# EasyEDA Pro project Sprig-C3 V1.0.1.epro, board PCB6
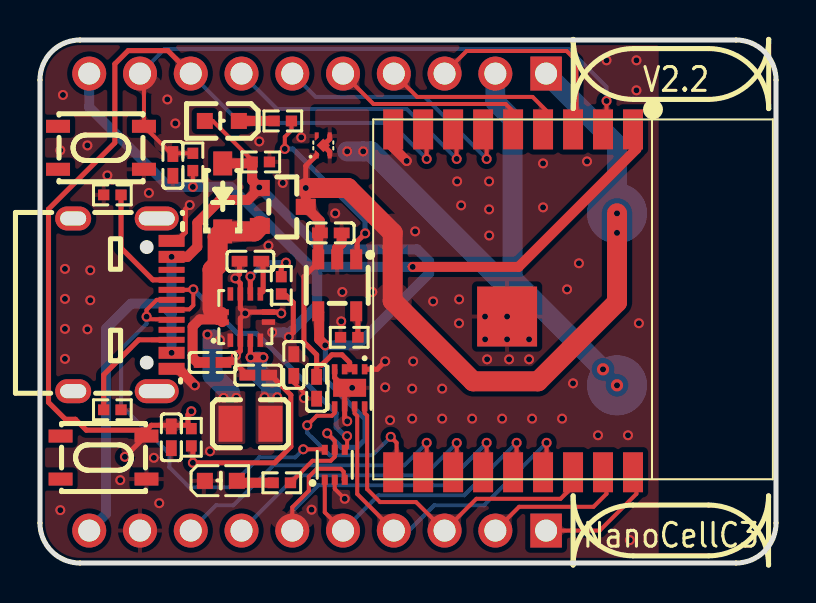
[diagram p8: board, top side]
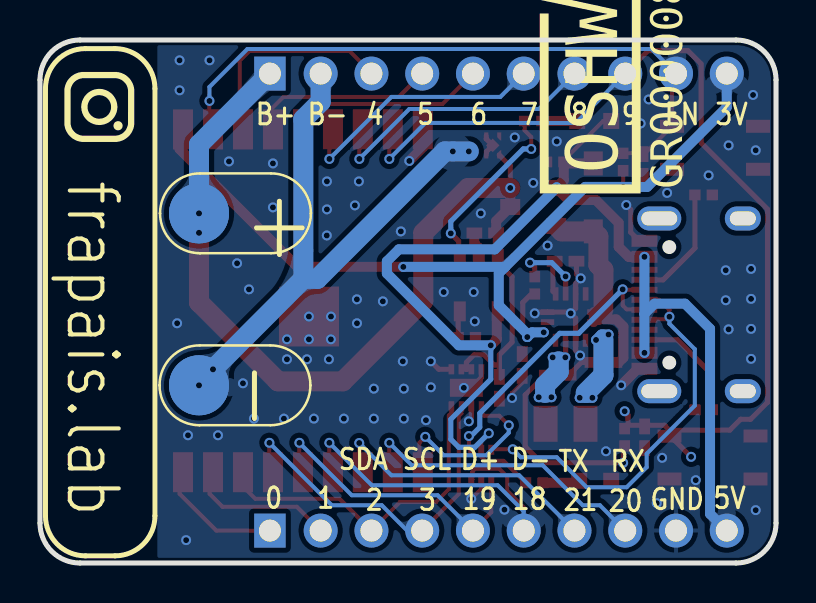
[diagram p9: board, bottom side, seen from below]

Outline 36.83 x 26.16 mm; copper layers: Top Layer, Bottom Layer. Coordinates in mm from the lower left corner of the outline.
Outline path: 0,24.16 0,2 arc(0.59,0.59) 2,0 34.83,0 arc(36.24,0.59) 36.83,2 36.83,24.16 arc(36.24,25.58) 34.83,26.16 2,26.16 arc(0.59,25.58) 0,24.16
Stack: Top Layer 0.035mm / Dielectric1 1.51mm FR4 er 4.5 / Bottom Layer 0.035mm

## Design rules (mm)
template: Custom Config
spacing copperThickness1oz (default): track to track 0.102, other pairs 0.152 to 0.3
spacing copperThickness2oz: track to track 0.203, other pairs 0.152 to 0.3
track width copperThickness1oz (default): min 0.127, default 0.254, max 2.54
track width copperThickness2oz: min 0.203, default 0.254, max 2.54
differential pair differentialPair (default): width min 0.127, default 0.254, max 2.54; gap min 0.152, default 0.152
via viaSize (default): diameter min 0.5, default 0.61, max 10; hole min 0.3, default 0.305, max 6.3
net $2N2104 uses copperRegion1
net $2N2094 uses copperRegion1
net 3.3V uses copperRegion1

## Placement (name value [footprint] x y rotation side)
BOOT  TSA016A2518C  [SW-SMD_4P-L4.2-W3.3-P2.15-LS4.6]  3.18 5.28 0 top
C1  100nF  [C0402]  6.65 19.91 90 top
C2  100nF  [C0402]  6.57 6.29 90 top
C8  100nF  [C0402]  13.84 8.76 90 top
C21  10uF  [C0402]  14.55 16.51 180 top
C22  10uF  [C0402]  10.92 9.4 0 top
C23  10uF  [C0402]  12.7 9.91 90 top
C24  10uF  [C0402]  8.64 10.03 180 top
C25  1nF  [C0402]  10.53 15.09 0 top
CHG1  MHT192CSCT  [LED0603-R-RD_ORANGE]  9.1 22.11 180 top
D1  B5819W SL  [SOD-123_L2.7-W1.6-LS3.7-RD-1]  9.14 18.29 90 top
D2  USBLC6-2P6  [SOT-666-6_L1.6-W1.2-P0.50-LS1.6-BL]  14.75 4.91 0 top
H1  DZ254R-11-10-63  [HDR-TH_10P-P2.54-V-M]  13.89 24.48 180 top
H2  DZ254R-11-10-63  [HDR-TH_10P-P2.54-V-M]  13.89 1.62 180 top
L1  1.5uH  [L0806]  10.53 6.97 180 top
NOREF  -  [Pad_e619]  28.87 8.89 0 top
NOREF#2  -  [Pad_e125]  28.87 8.89 0 top
NOREF#3  -  [Pad_e124]  28.87 17.49 0 top
NOREF#4  -  [Pad_e620]  28.87 17.49 0 top
PWR1  E6C0603CWAY1UDA  [LED0603-R-RD_WHITE]  9.05 4.11 0 top
Q2  AO3401A  [SOT-23_L2.9-W1.3-P1.90-LS2.4-BR]  12.15 17.81 180 top
R1  10kΩ  [R0402]  7.65 20.06 270 top
R2  10kΩ  [R0402]  7.57 6.29 270 top
R3  5.1kΩ  [R0402]  3.62 18.41 180 top
R4  5.1kΩ  [R0402]  3.62 7.66 180 top
R5  510Ω  [R0402]  12.1 4.01 180 top
R6  10kΩ  [R0402]  11.05 20.06 180 top
R7  330Ω  [R0402]  12.15 22.11 0 top
R8  2.32kΩ  [R0402]  15.47 11.29 0 top
R12  1MΩ  [R0402]  12.07 13.89 270 top
RST  TSA016A2518C  [SW-SMD_4P-L4.2-W3.3-P2.15-LS4.6]  3.05 20.77 0 top
U1  2.4GHz  [FOOTPRINT-ESP32-C3-WROOM-02]  29.67 21.69 270 top
U3  MAX17048G+T10  [DFN-8_L2.0-W2.0-P0.50-BL-EP]  15.49 8.76 180 top
U4  TP4065-4.2V-SOT25-R  [SOT-23-5_L3.0-W1.7-P0.95-LS2.8-BR]  14.87 13.89 90 top
U7  TPS63051RMWR  [QFN-12_L2.5-W2.5-P0.50-TL]  10.28 12.3 90 top
U8  AP6683  [DFN-4_L1.0-W1.0-P0.65-BL-EP]  14.17 20.89 0 top
USB1  U262-161N-4BVC11  [USB-3.1-SMD_U262-161N-4BVC11]  4.12 12.91 270 top

## Footprints (pads in the part's own frame, mm; a bottom-side part is the same pattern mirrored in y, then rotated)
C0402
  rect 0.79x0.54 smd: 1(-0.545,0) 2(0.545,0)
DFN-4_L1.0-W1.0-P0.65-BL-EP
  custom 0.2x0.4 smd: 1(-0.325,-0.475) 2(0.325,-0.474) 3(0.325,0.475) 4(-0.325,0.475)
  rect 0.48x0.48 smd rot 45: 5(0.004,0.001)
DFN-8_L2.0-W2.0-P0.50-BL-EP
  rect 0.28x0.505 smd: 1(-0.75,-0.927) 2(-0.25,-0.927) 3(0.25,-0.927) 4(0.75,-0.927) 5(0.75,0.927) 6(0.25,0.927) 7(-0.25,0.927) 8(-0.75,0.927)
  rect 1.65x0.9 smd: 9(0,0)
FOOTPRINT-ESP32-C3-WROOM-02
  rect 2x1 smd: 1(0,0) 2(0,-1.5) 3(0,-3) 4(0,-4.5) 5(0,-6) 6(0,-7.5) 7(0,-9) 8(0,-10.5) 9(0,-12) 10(17.15,-12) 11(17.15,-10.5) 12(17.15,-9) 13(17.15,-7.5) 14(17.15,-6) 15(17.15,-4.5) 16(17.15,-3) 17(17.15,-1.5) 18(17.15,0)
  rect 3x3 smd: 19(9.36,-6.3)
HDR-TH_10P-P2.54-V-M
  rect 1.575x1.7 hole 1.1: 1(-11.43,0)
  round 1.7 hole 1.1: 2(-8.89,0) 3(-6.35,0) 4(-3.81,0) 5(-1.27,0) 6(1.27,0) 7(3.81,0) 8(6.35,0) 9(8.89,0) 10(11.43,0)
L0806
  rect 1.2x1.8 smd: 1(-1,0) 2(1,0)
LED0603-R-RD_ORANGE
  rect 0.8x0.8 smd: 1(0.851,0) 2(-0.851,0)
LED0603-R-RD_WHITE
  rect 0.8x0.8 smd: 1(0.8,0) 2(-0.8,0)
Pad_e124
  round 3 smd far side: 1(0,0)
Pad_e125
  round 3 smd far side: 2(0,0)
Pad_e619
  round 3 smd far side: 2(0,0)
Pad_e620
  round 3 smd far side: 1(0,0)
QFN-12_L2.5-W2.5-P0.50-TL
  rect 0.665x0.28 smd: 1(-1.157,0.75) 2(-1.157,0.25) 3(-1.157,-0.25) 4(-1.157,-0.75) 7(1.157,-0.75) 8(1.157,-0.25) 9(1.157,0.25) 10(1.157,0.75)
  rect 0.28x0.665 smd: 5(-0.25,-1.157) 6(0.25,-1.157) 11(0.25,1.157) 12(-0.25,1.157)
R0402
  rect 0.566x0.54 smd: 1(-0.433,0) 2(0.433,0)
SOD-123_L2.7-W1.6-LS3.7-RD-1
  rect 1.2x0.95 smd: 1(-1.7,0) 2(1.7,0)
SOT-23-5_L3.0-W1.7-P0.95-LS2.8-BR
  rect 1x0.6 smd: 1(1.3,-0.95) 2(1.3,0) 3(1.3,0.95) 4(-1.3,0.95) 5(-1.3,-0.95)
SOT-23_L2.9-W1.3-P1.90-LS2.4-BR
  rect 1x0.8 smd: 1(1.15,-0.95) 2(1.15,0.95) 3(-1.15,0)
SOT-666-6_L1.6-W1.2-P0.50-LS1.6-BL
  rect 0.3x0.5 smd: 1(-0.5,-0.75) 2(0,-0.75) 3(0.5,-0.75) 4(0.5,0.75) 5(0,0.75) 6(-0.5,0.75)
SW-SMD_4P-L4.2-W3.3-P2.15-LS4.6
  rect 1.2x0.65 smd: 1(-2.15,1.075) 2(2.15,1.075) 3(-2.15,-1.075) 4(2.15,-1.075)
USB-3.1-SMD_U262-161N-4BVC11
  rect 0.6x1.3 smd: A1B12(-3.2,2.462) A4B9(-2.4,2.462) B1A12(3.2,2.462) B4A9(2.4,2.462)
  rect 0.3x1.3 smd: A5(-1.25,2.462) A6(-0.25,2.462) A7(0.25,2.462) A8(1.25,2.462) B5(1.75,2.462) B6(0.75,2.462) B7(-0.75,2.462) B8(-1.75,2.462)
  oval 1.2x2.2 hole 0.7x1.8: SHELL(-4.32,1.719) SHELL(4.32,1.719)
  oval 1.2x1.8 hole 0.7x1.3: SHELL(-4.32,-2.462) SHELL(4.32,-2.462)

## Nets
As in the schematic, except:
VBAT: C8.2 C21.2 H1.1 NOREF#3.1 NOREF#4.1 Q2.3 U3.2 U3.3 U4.3 U8.1
B-: H1.2 NOREF.2 NOREF#2.2 U8.2 U8.3 U8.5

Pads without a net: BOOT 1 3; RST 1 3; U7 10; USB1 A8 B8 SHELL

## Via types
v1: diameter 0.5, hole 0.3, Top Layer to Bottom Layer, 123 vias
v2: diameter 0.61, hole 0.305, Top Layer to Bottom Layer, 4 vias

## Routing (per net, layer and track width the routed paths; a pad name or vN(x,y) marks a point on that pad's centre or on a via; arc(x,y) is an arc through that point)
3.3V: length 54.3
  Top Layer w0.2: R1.2 v1(7.65,18.81)
  Top Layer w0.254: C22.2 11.56,9.4 12.55,8.4 12.55,5.82 11.74,5.01 v1(7.65,5.01) 7.65,5.78 R2.2 ; 12.31,13.39 12.67,13.03 12.67,11.53 v1(12.45,11.3)
  Top Layer w0.5: v1(18.65,14.81) 23.95,14.81 29.84,20.71 29.84,21.67
  Bottom Layer w0.5: 13.55,14.81 9.55,18.81 v1(7.65,18.81) 6.45,18.81 2.47,22.8 H1.10 ; 13.55,14.81 13.87,14.49 13.87,12.89 12.45,11.46 v1(12.45,11.3) 12.21,11.54 v1(11.62,11.54) ; 13.55,14.81 v1(18.65,14.81)
GND: length 22.6
  Top Layer w0.2: v1(15.25,3.21) 14.75,3.71 D2.2 ; v1(13.21,8.25) 13.21,8.51 12.7,9.02 C23.1
  Top Layer w0.254: U3.1 16.87,9.69 v1(17.27,10.09) ; 9.44,10.03 10.03,10.62 U7.2 10.03,12.24 v1(10.27,12.49) ; 9.44,10.03 9.42,10.02 ; 9.44,10.03 9.74,10.03 C22.1 ; C25.1 9.99,14.45 v1(9.77,14.24) 10.03,13.98 U7.9 10.03,12.73 v1(10.27,12.49) ; v1(10.27,12.49) 10.33,12.55 U7.6 12.01,12.55 v1(12.07,12.49) ; v1(15.37,7.09) 15.24,7.22 U3.6 15.24,8.51 U3.9 15.25,8.76 14.74,9.27 U3.4 ; USB1.A1B12 6.84,16.11 7.27,16.54 7.27,17.69 v1(7.49,17.91)
  Top Layer w0.5: U4.2 14.86,15.2 14.86,15.75 15.09,15.98 C21.1 ; v1(18.35,20.11) 17.65,20.81 17.65,21.48 ; USB1.B1A12 6.92,9.71 v1(7.75,8.89)
  vias: v1(1.02,20.64) v1(1.02,2.64) v1(1.15,23.41) v1(1.25,14.71) v1(1.25,13.21) v1(1.25,11.71) v1(1.25,10.21) v1(2.37,20.89) v1(2.37,11.69) v1(2.52,14.64) v1(2.52,13.14) v1(3.37,19.39) v1(4.02,4.14) v1(5.45,18.51) v1(5.7,5.26) v1(5.97,2.99) v1(6.37,23.19) v1(6.77,21.99) v1(8.51,5.59) v1(9.8,10.38) v1(10.97,21.09) v1(11.43,15.88) v1(12.15,19.01) v1(13.07,21.29) v1(13.59,2.67) v1(14.77,17.49) v1(15.07,12.09) v1(15.13,13.56) v1(15.62,8.76) v1(16.63,13.56) v1(17.27,8.79) v1(17.52,7.14) v1(18.67,10.09) v1(18.62,8.72) v1(18.62,7.22) v1(18.77,16.59) v1(19.67,13.09) v1(20.12,8.72) v1(20.12,7.22) v1(20.87,19.09) v1(20.97,13.19) v1(20.97,11.99) v1(21.07,17.89) v1(21.62,7.22) v1(22.27,12.33) v1(22.27,11.19) v1(22.37,10.19) v1(22.47,19.09) v1(22.47,17.69) v1(22.48,16.38) v1(23.12,7.22) v1(23.37,12.33) v1(23.37,11.19) v1(23.47,10.19) v1(24.47,11.19) v1(24.47,10.19) v1(24.62,7.22) v1(25.17,19.99) v1(25.17,17.79) v1(26.12,7.22) v1(26.37,13.69) v1(26.67,8.99) v1(26.97,14.99) v1(27.37,20.09) v1(27.92,6.39) v1(28.35,25.14) v1(29.42,6.39) v1(29.52,1.14) v1(29.85,25.14) v1(29.85,23.64) v1(29.97,11.99)
VBAT: length 51.2
  Top Layer w0.254: U8.1 13.3,19.87 v1(13.3,18.76) ; 15.49,9.69 15.49,10.03 15.11,10.41 14.6,10.41 14.1,9.91 13.84,9.91 ; U4.3 13.92,15.03 13.21,14.32 13.21,11.05 13.84,10.41 13.84,9.91 ; 13.84,9.91 C8.2 ; U3.2 U3.3
  Top Layer w0.5: U4.3 13.92,16.43 C21.2 14,17.11 Q2.3 v1(13.3,18.76)
  Top Layer w1: v2(28.87,17.49) v2(28.87,16.52) 28.87,13.04 24.92,9.09 21.67,9.09 17.65,13.11 17.65,16.51 15.4,18.76 v1(13.3,18.76)
  Bottom Layer w1: H1.1 28.87,20.93 v2(28.87,17.49)
VCC: length 63.2
  Top Layer w0.2: CHG1.1 8.65,22.11 10.62,20.14 R6.2 ; D2.5 14.75,5.31 14.55,5.11 13.63,5.11 R5.1 ; 14.75,5.66 14.75,6.11 v1(14.37,6.49)
  Top Layer w0.5: v1(6.58,15.31) 7.37,15.31 7.87,15.81 7.87,17.02 9.02,18.16 10.4,18.16 11,18.76 10.62,19.14 R6.2 10.54,19.99 D1.2 ; v1(14.27,10.89) 13.97,11.19 13.97,12.54 U4.4
  Bottom Layer w0.254: v1(14.27,10.89) 14.27,9.19 16.27,7.19 16.27,6.19 15.87,5.79 15.07,5.79 v1(14.37,6.49)
  Bottom Layer w0.5: 6.58,12.47 6.08,12.97 4.56,12.97 3.3,11.72 3.3,2.46 H2.10 ; 6.58,12.47 v1(6.58,10.51) ; 6.58,12.47 v1(6.58,15.31) ; v1(10.97,18.79) 14.07,15.69 18.87,15.69 19.47,15.09 19.47,14.49 15.87,10.89 v1(14.27,10.89)
VIN: length 9.8
  Top Layer w0.5: 8.77,12.19 8,12.19 7.64,11.83 7.64,10.27 7.89,10.02 ; U7.12 U7.11
  Top Layer w1: 8.64,12.7 8.64,14.67 8.89,14.92 8.89,16.33 9.14,16.59 10.73,16.59 11,16.86
ALRT: length 9.3
  Top Layer w0.2: v1(17.55,6.31) 17.84,6.02 17.84,4.52 ; v1(13.37,6.89) 13.85,7.37 14.6,7.37 14.74,7.5 U3.5
  Bottom Layer w0.2: v1(17.55,6.31) 16.63,5.39 14.5,5.39 13.37,6.51 v1(13.37,6.89)
B-: length 30.2
  Top Layer w0.254: U8.3 14.5,21.21 U8.5 14.5,20.57 U8.2
  Bottom Layer w1: 23.65,14.21 23.65,22.2 22.78,23.07 H1.2 ; 23.65,14.21 v2(28.17,9.69) 28.87,8.99 v2(28.87,8.89) ; 23.65,14.21 22.95,14.21 16.57,20.59 v1(16.17,20.59) v1(15.37,20.59)
CHG1: length 9.1
  Top Layer w0.2: v1(12.25,20.71) 12.25,21.31 12.58,21.64 R7.2
  Top Layer w0.254: U4.1 15.88,15.24 15.88,16.09 v1(16.27,16.49)
  Bottom Layer w0.254: v1(12.25,20.71) 12.65,20.71 16.27,17.09 v1(16.27,16.49)
CHG2: length 1.8
  Top Layer w0.5: CHG1.2 R7.1
D00: length 6.3
  Top Layer w0.2: H2.1 28.01,1.62 29.84,3.46 29.84,4.52
D01: length 7.4
  Top Layer w0.2: H2.2 23.98,2.81 27.7,2.81 28.34,3.46 28.34,4.52
D04: length 10.7
  Top Layer w0.2: 26.84,21.67 26.84,25.12 26.35,25.61 21.35,25.61 20.25,24.51 H1.3
D05: length 9.4
  Top Layer w0.2: 25.34,21.67 25.34,22.62 24.65,23.31 18.87,23.31 H1.4
D06: length 10.3
  Top Layer w0.2: H1.5 16.69,22.96 23.3,22.96 23.84,22.42 23.84,21.67
D07: length 13
  Top Layer w0.2: 22.35,21.67 22.35,20.21
  Bottom Layer w0.2: H1.6 13.8,23.31 19.25,23.31 22.35,20.21
  vias: v1(22.35,20.21)
D08: length 14
  Top Layer w0.2: v1(20.85,20.21) 20.84,20.22 20.84,21.67
  Bottom Layer w0.2: v1(20.85,20.21) 18.35,22.71 11.86,22.71 H1.7
D09: length 48.4
  Top Layer w0.2: v1(19.35,20.21) 19.34,20.22 19.34,21.67
  Top Layer w0.254: H1.8 6.4,25.63 4.41,25.63 3.75,24.96 3.75,21.02 0.43,17.7 0.43,8.03 1.27,7.19 1.77,7.19 2.32,6.65 5.33,6.65 ; 5.33,6.65 BOOT.2 5.29,6.35 v1(4.25,5.31) ; 5.33,6.65 5.57,6.89 7.41,6.89 ; v1(7.57,7.59) 7.41,7.42 7.41,6.89 ; 7.41,6.89 R2.1
  Bottom Layer w0.2: 19.35,20.21 17.55,22.01 10.01,22.01 H1.8
D+: length 14.9
  Top Layer w0.2: v1(23.85,6.01) 23.84,4.52 ; H2.5 14.25,2.54 D2.1
  Bottom Layer w0.2: H2.5 16.93,3.39 21.23,3.39 v1(23.85,6.01)
D-: length 19.1
  Top Layer w0.2: D2.3 15.2,4.16 15.2,4.56 15.05,4.71 13.85,4.71 13.45,4.31 13.45,3.61 12.62,2.79 H2.6 ; 22.35,6.01 22.35,4.52
  Bottom Layer w0.2: H2.6 12.62,2.59 13.93,3.89 20.23,3.89 22.35,6.01
  vias: v1(22.35,6.01)
DN1: length 15
  Top Layer w0.2: D2.4 15.37,5.78 v1(15.37,6.35) ; USB1.B7 7.65,13.66 v1(7.67,13.69) 7.67,12.89 7.47,12.69 6.61,12.69 USB1.A7
  Bottom Layer w0.254: v1(15.37,6.35) 15.26,6.35 14.82,6.79 14.82,7.49 10.82,11.49 9.87,11.49 v1(7.67,13.69)
DP1: length 21.2
  Top Layer w0.2: D2.6 14.22,5.69 v1(13.17,5.69) ; USB1.B6 6.56,12.19 5.46,12.19 v1(5.33,12.32) 5.33,12.66 5.84,13.16 USB1.A6
  Bottom Layer w0.2: v1(5.33,12.32) 5.33,11.97 4.06,10.7 4.06,7.87 6.47,5.47 6.47,4.79 7.47,3.79 9.47,3.79 10.97,5.29 12.77,5.29 v1(13.17,5.69)
EN: length 32.5
  Top Layer w0.2: 28.34,21.67 28.35,21.68 v1(28.35,23.11) ; H1.9 5.2,24.28 RST.2 6.59,20.46 C1.2 6.69,20.5 R1.1
  Bottom Layer w0.2: H1.9 6.24,25.71 26.45,25.71 28.35,23.81 v1(28.35,23.11)
PROG: length 1.3
  Top Layer w0.254: R8.2 15.91,12.51 U4.5
RX: length 15.1
  Top Layer w0.2: 19.34,4.52 19.35,4.53 v1(19.35,6.01)
  Bottom Layer w0.2: 19.35,6.01 18.23,4.89 11.67,4.89 9.67,2.89 8.81,2.89 H2.8
SCL: length 18
  Top Layer w0.2: U3.7 15.74,7.48 15.88,7.35 15.88,3.45 H2.4 ; 25.35,4.52 25.35,6.01
  Bottom Layer w0.2: H2.4 18.46,1.62 19.73,2.89 22.23,2.89 v1(25.35,6.01)
SDA: length 17
  Top Layer w0.2: U3.8 16.24,7.5 16.37,7.38 16.37,3.7 17.02,3.05 18.82,3.05 H2.3 21.84,3.21 26.05,3.21 26.84,4.01 26.84,4.52
TX: length 14.1
  Top Layer w0.2: v1(20.85,6) 20.84,4.52
  Bottom Layer w0.2: v1(20.85,6) 19.24,4.39 12.85,4.39 H2.7
$1N6: length 1.8
  Top Layer w0.5: 9.9,4.11 10,4.01 R5.2
$2N589: length 5.8
  Top Layer w0.254: R3.1 4.06,15.76 5.65,14.16 USB1.A5
$2N592: length 5.9
  Top Layer w0.254: USB1.B5 4.94,11.16 3.19,9.41 R4.2
$2N2094: length 4
  Top Layer w0.254: U7.3 10.53,10.27
  Top Layer w0.3: v1(10.54,10.29) 10.53,10.27
  Top Layer w0.5: v1(11.18,10.29) v1(10.54,10.29)
  Bottom Layer w0.5: v1(11.24,8.29) v1(11.87,8.29)
  Bottom Layer w1: 11.56,8.51 11.56,8.89 10.87,9.57 10.87,10.09
$2N2104: length 4.4
  Bottom Layer w0.5: v1(8.38,11.43) 8.73,11.43 v1(9.01,11.16) ; v1(9.82,8.27) v1(9.19,8.27)
  Bottom Layer w1: 9.52,8.51 8.64,9.4 8.64,11.18
$2N2176: length 3.7
  Top Layer w0.254: v1(10.53,14.33) 10.53,14.33 U7.8 ; v1(12.31,15.02) 12.07,14.79 R12.1
  Bottom Layer w0.254: v1(10.53,14.33) 11.22,15.02 v1(12.31,15.02)
$2N2214: length 1.7
  Top Layer w0.254: 11.08,15.09 11.17,15 11.17,13.6 U7.7

## Copper pours and planes (outline as drawn; the poured copper is in the pictures)
3.3V on Top Layer: 10.78,12.21 12.53,12.21 13.45,11.28 13.45,9.99 13.35,9.89 12.73,9.89 12.57,9.73 12.57,9.02 12.31,8.75 11.54,8.75 11.29,9 11.29,9.76 11.55,10.02 11.55,10.52 10.92,10.52 10.78,10.65
GND on Top Layer: -2.14,27.09 30.96,26.99 30.96,-0.01 -3.03,-0.01
GND on Bottom Layer: -2.14,27.09 30.96,26.99 30.96,-0.01 -0.04,-0.01
VBAT on Top Layer: 12.73,20.73 14.17,20.73 14.17,17.69 12.73,17.69
VIN on Top Layer: 9.53,13.66 9.53,11.67 7.99,11.67 7.99,10.7 8.91,10.7 8.94,10.67 8.94,9.33 7.56,9.33 7.49,9.4 7.49,13.59 7.42,13.66
B- on Top Layer: 13.77,22.69 16.47,22.69 16.47,19.19 13.77,19.19
$2N2094 on Top Layer: 10.79,8.6 12.3,8.6 12.3,5.95 10.79,5.95
$2N2104 on Top Layer: 8.77,8.6 10.28,8.6 10.28,5.95 8.77,5.95
$2N2104 on Top Layer: 7.99,11.67 9.77,11.67 9.77,10.7 7.99,10.7

Small or netless copper shapes (teardrops, artwork), in the pictures only: 161 on Top Layer, 42 on Bottom Layer

## Text on the board
Bottom Silkscreen Layer: GND | 9 | RX | 8 | TX | 7 | D- | 6 | D+ | 3 | 5 | SCL | 4 | 2 | SDA | 1 | 0 | 3V | 5V | EN | 20 | 21 | 18 | 19 | B- | B+ | frapais.lab | + | -
Top Silkscreen Layer: NanoCellC3 | V2.2
